# EAGLE design Little Helper Rev 1.9 (EAGLE 7.2.0)
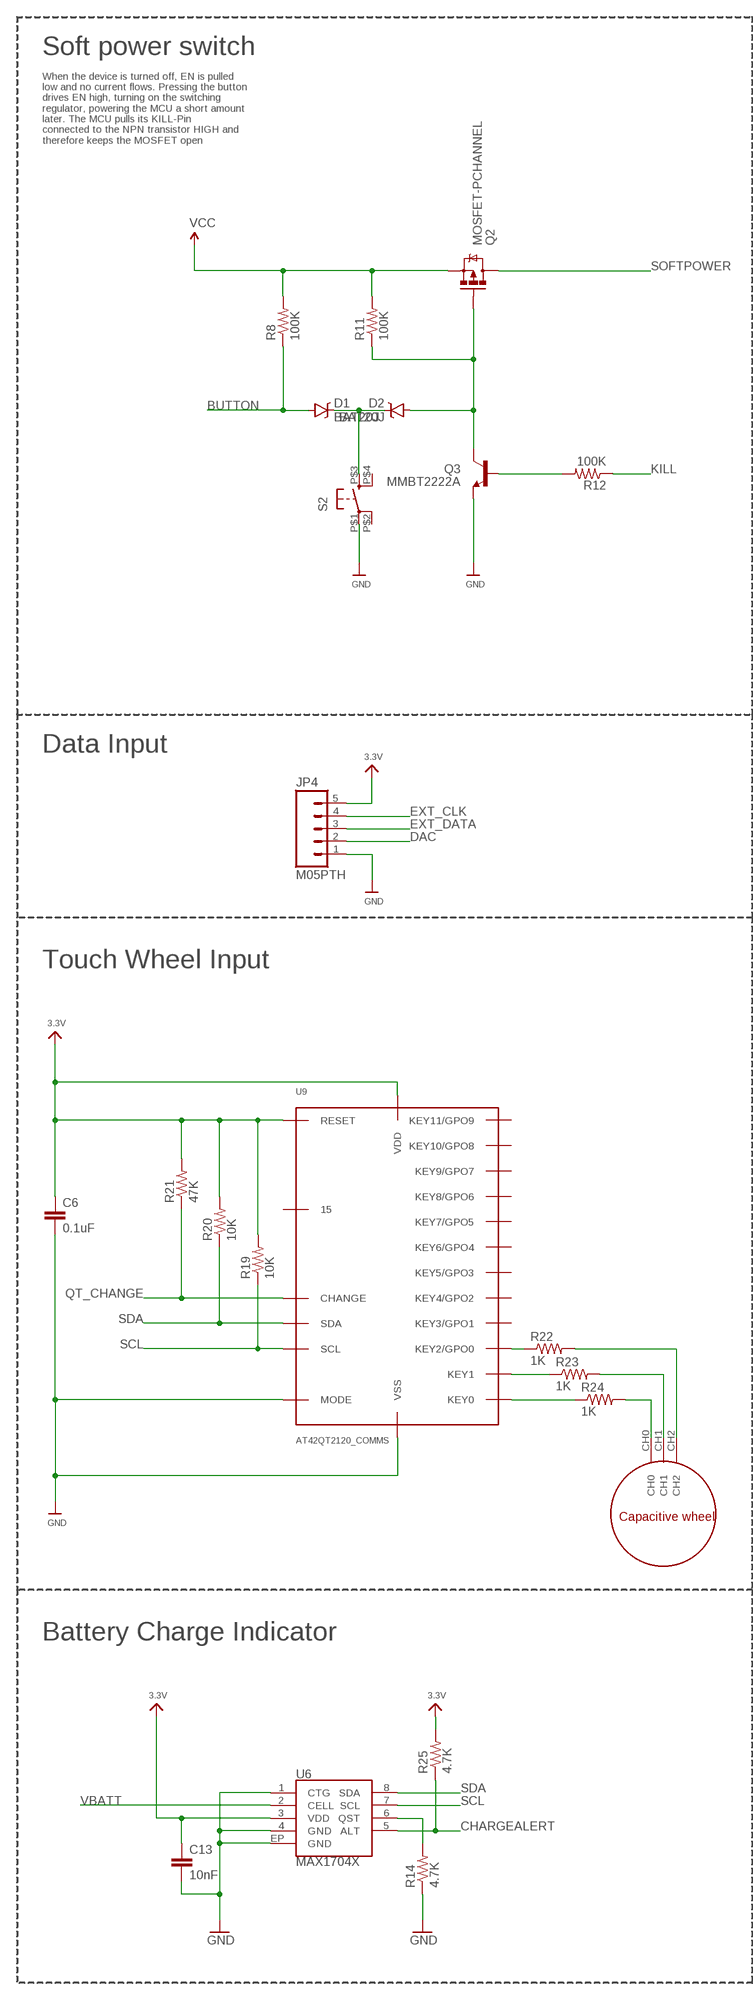
[diagram p0: schematic, sheet 1, part 1 of 2]
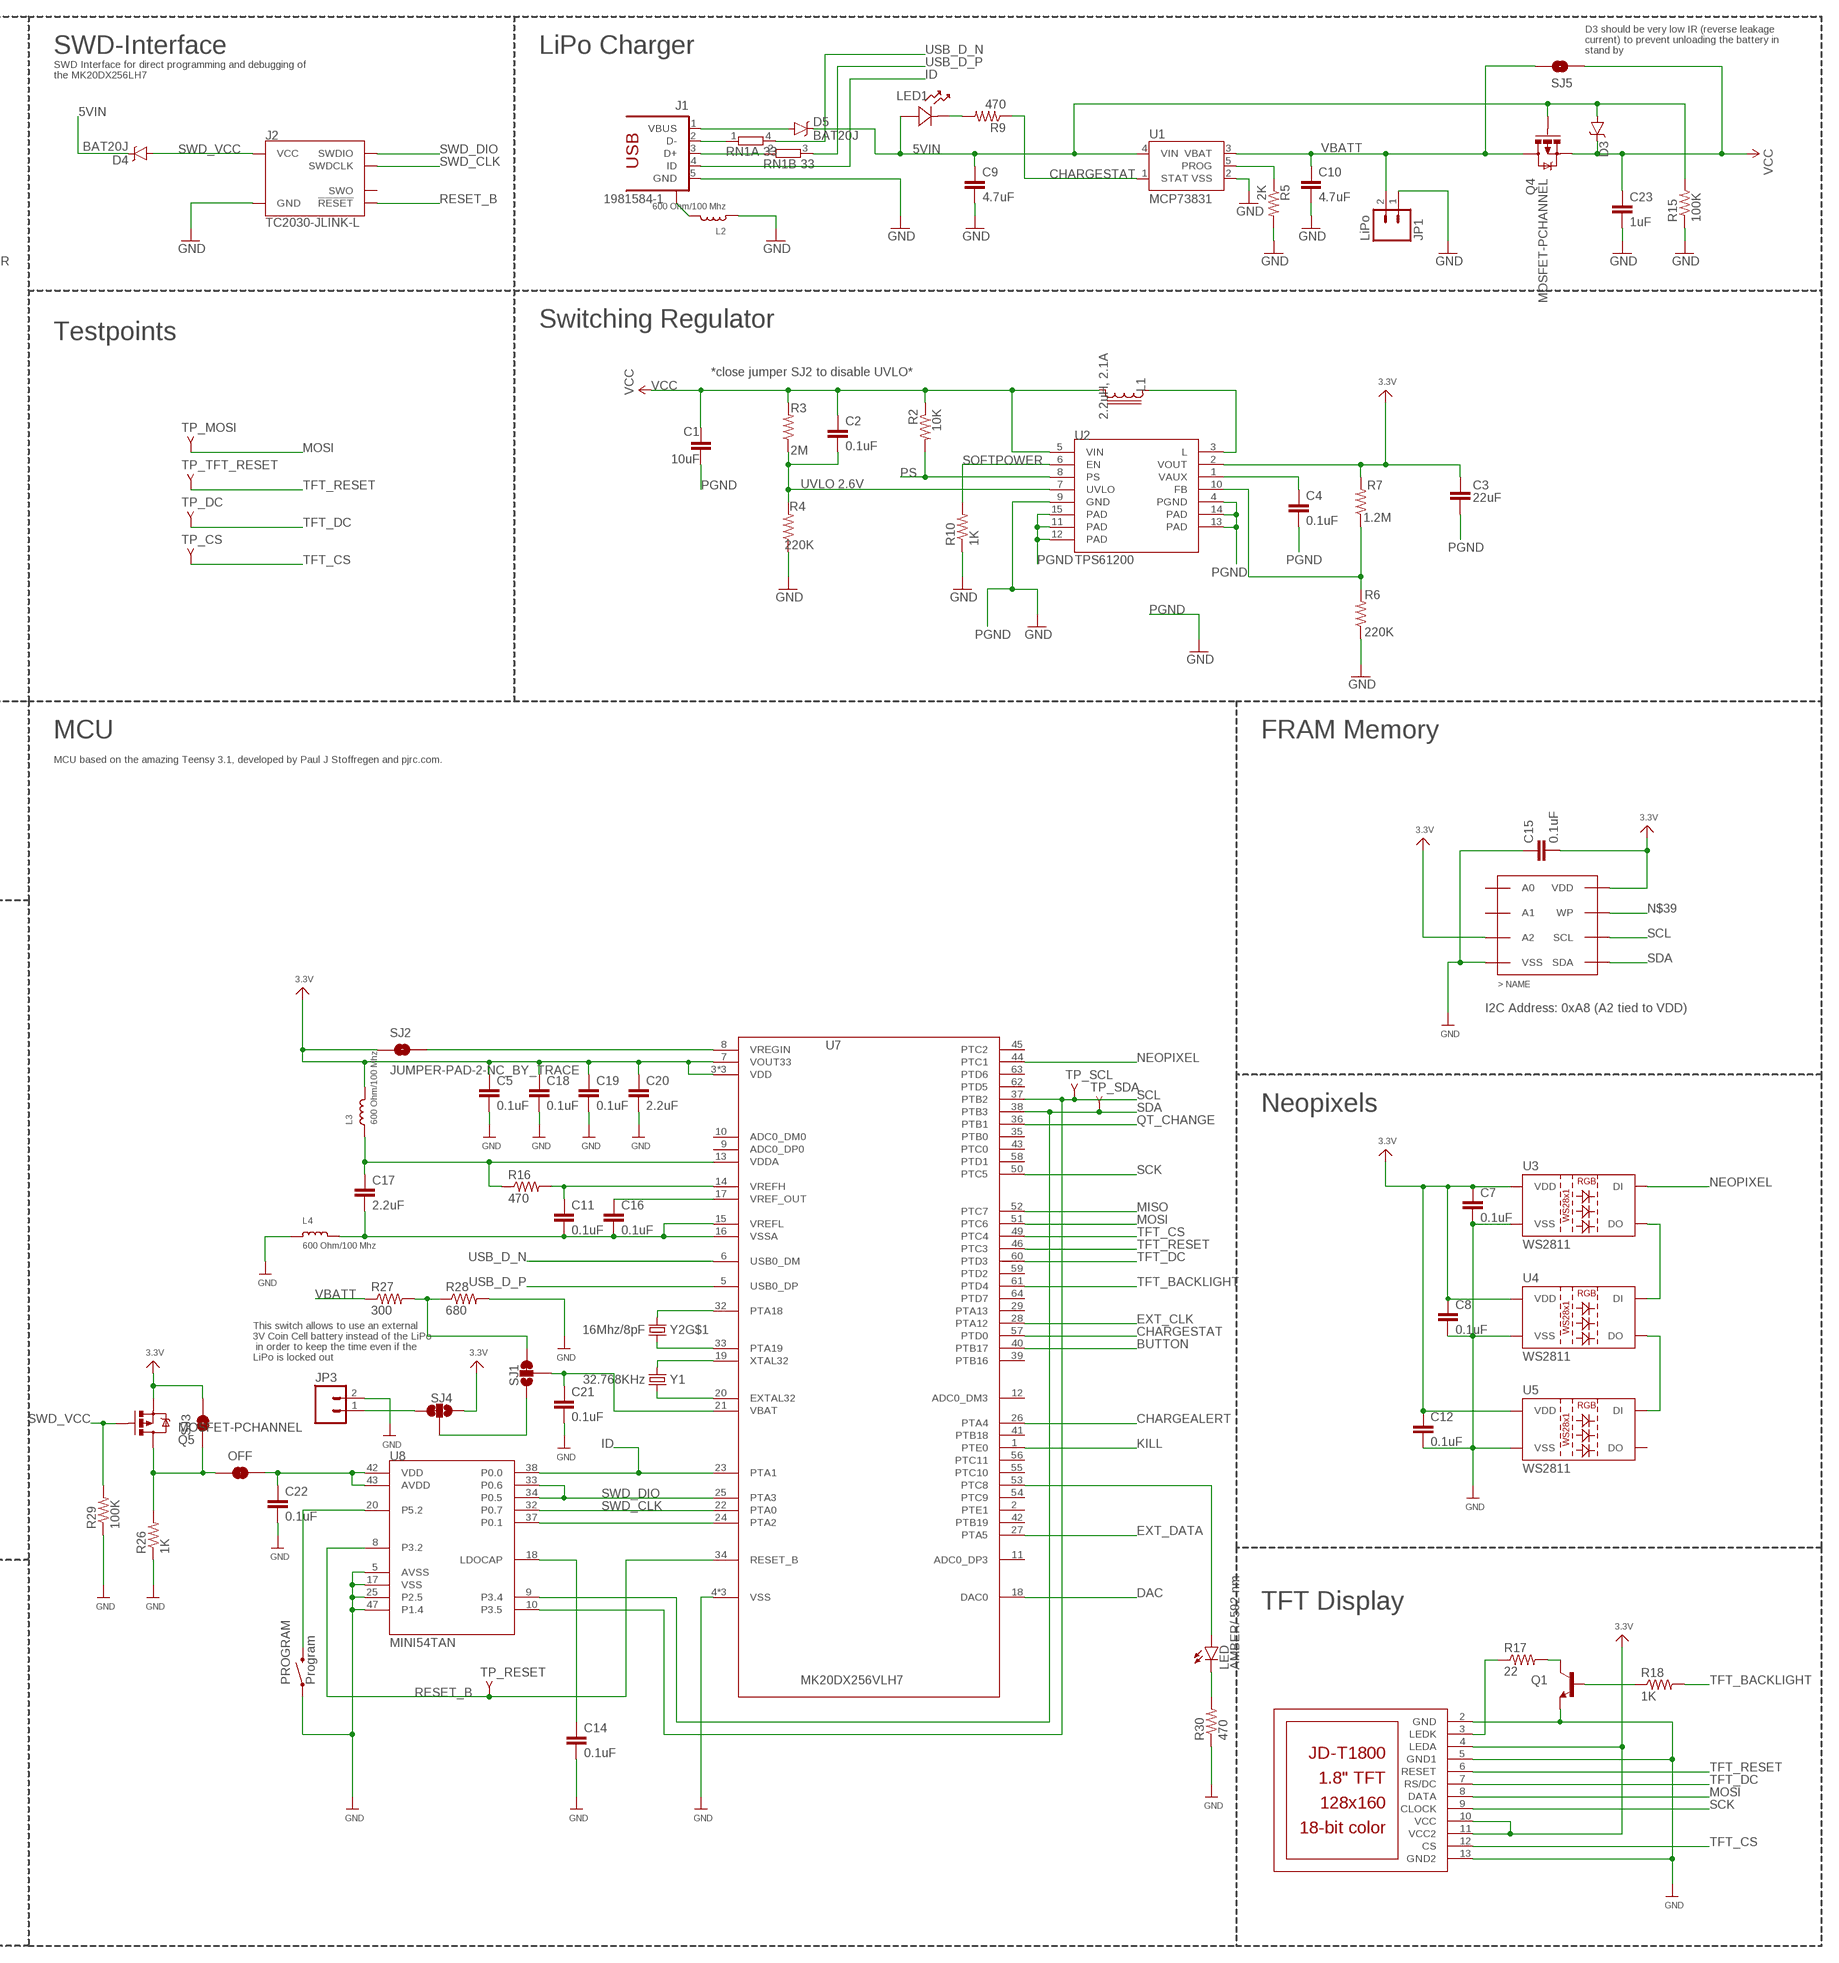
[diagram p1: schematic, sheet 1, part 2 of 2]

## Parts
C1  10uF  CAPACITOR-10UF  [0603-CAP]
C2  0.1uF  CAPACITOR-0.1UF  [0603-CAP]
C3  22uF  CAPACITOR-22UF  [0603-CAP]
C4  0.1uF  CAPACITOR-0.1UF  [0603-CAP]
C5  0.1uF  CAPACITOR-0.1UF  [0603-CAP]
C6  0.1uF  CAPACITOR-0.1UF  [0603-CAP]
C7  0.1uF  CAPACITOR-0.1UF  [0603-CAP]
C8  0.1uF  CAPACITOR-0.1UF  [0603-CAP]
C9  4.7uF  CAPACITOR-4.7UF  [0603-CAP]
C10  4.7uF  CAPACITOR-4.7UF  [0603-CAP]
C11  0.1uF  CAPACITOR-0.1UF  [0603-CAP]
C12  0.1uF  CAPACITOR-0.1UF  [0603-CAP]
C13  10nF  CAPACITOR-10NF  [0603-CAP]
C14  0.1uF  CAPACITOR-0.1UF  [0603-CAP]
C15  0.1uF  CAPACITOR-0.1UF  [0603-CAP]
C16  0.1uF  CAPACITOR-0.1UF  [0603-CAP]
C17  2.2uF  CAPACITOR-2.2UF  [0603-CAP]
C18  0.1uF  CAPACITOR-0.1UF  [0603-CAP]
C19  0.1uF  CAPACITOR-0.1UF  [0603-CAP]
C20  2.2uF  CAPACITOR-2.2UF  [0603-CAP]
C21  0.1uF  CAPACITOR-0.1UF  [0603-CAP]
C22  0.1uF  CAPACITOR-0.1UF  [0603-CAP]
C23  1uF  CAPACITOR-1UF  [0603-CAP]
D1  BAT20J  DIODE-SCHOTTKY-BAT20J  [SOD-323]
D2  BAT20J  DIODE-SCHOTTKY-BAT20J  [SOD-323]
D3  DIODE-SCHOTTKY-LOW_LEAKAGE  [SOD-323]
D4  BAT20J  DIODE-SCHOTTKY-BAT20J  [SOD-323]
D5  BAT20J  DIODE-SCHOTTKY-BAT20J  [SOD-323]
J1  1981584-1  [1981584-1]
J2  TC2030-JLINK-L  [TC2030-IDC]
JP1  LiPo  M02-JST-2MM-SMT  [JST-2-SMD]
JP3  M02PTH  [1X02]
JP4  M05PTH  [1X05]
L1  2.2uH, 2.1A  LPS30152.2UH  [LPS3015]
L2  600 Ohm/100 Mhz  INDUCTOR-BK2125HM601-T  [0805]
L3  600 Ohm/100 Mhz  INDUCTOR-BK2125HM601-T  [0805]
L4  600 Ohm/100 Mhz  INDUCTOR-BK2125HM601-T  [0805]
LCD1  JD-T1800  [JD-T1800]
LED  AMBER/ 592 nm  LED-AMBER  [LED-0603]
LED1  597-2311-407F  [LED_597-2311-407F]
OFF  JUMPER-PAD-2-NC_BY_TRACE  [PAD-JUMPER-2-NC_BY_TRACE_YES_SILK]
PROGRAM  Program  SWITCH-MOMENTARY-2-SMD-1101NE  [TACTILE-SWITCH-1101NE]
Q1  TRANSISTOR_NPNSOT23-3  [SOT23-3]
Q2  MOSFET-PCHANNEL  [SOT23-3]
Q3  MMBT2222A  TRANSISTOR_NPNSOT23-3  [SOT23-3]
Q4  MOSFET-PCHANNEL  [SOT23-3]
Q5  MOSFET-PCHANNEL  [SOT23-3]
R2  10K  RESISTOR-10K  [0603-RES]
R3  2M  RESISTOR-2M  [0603-RES]
R4  220K  RESISTOR-220K  [0603-RES]
R5  2K  RESISTOR-2K  [0603-RES]
R6  220K  RESISTOR-220K  [0603-RES]
R7  1.2M  RESISTOR-1.2M  [0603-RES]
R8  100K  RESISTOR-100K  [0603-RES]
R9  470  RESISTOR-470  [0603-RES]
R10  1K  RESISTOR-1K  [0603-RES]
R11  100K  RESISTOR-100K  [0603-RES]
R12  100K  RESISTOR-100K  [0603-RES]
R14  4.7K  RESISTOR-4.7K  [0603-RES]
R15  100K  RESISTOR-100K  [0603-RES]
R16  470  RESISTOR-470  [0603-RES]
R17  22  RESISTOR-22  [0603-RES]
R18  1K  RESISTOR-1K  [0603-RES]
R19  10K  RESISTOR-10K  [0603-RES]
R20  10K  RESISTOR-10K  [0603-RES]
R21  47K  RESISTOR-47K  [0603-RES]
R22  1K  RESISTOR-1K  [0603-RES]
R23  1K  RESISTOR-1K  [0603-RES]
R24  1K  RESISTOR-1K  [0603-RES]
R25  4.7K  RESISTOR-4.7K  [0603-RES]
R26  1K  RESISTOR-1K  [0603-RES]
R27  300  RESISTOR-300  [0603-RES]
R28  680  RESISTOR-680  [0603-RES]
R29  100K  RESISTOR-100K  [0603-RES]
R30  470  RESISTOR-470  [0603-RES]
RN1  33  2R-NEXB34V  [EXB34V]
S2  TAC_SWITCHPTS645_SERIES  [PTS645_BUTTON_SERIES]
SJ1  JUMPER-PAD-3-2OF3_NC_BY_TRACE  [PAD-JUMPER-3-2OF3_NC_BY_TRACE_YES_SILK_FULL_BOX]
SJ2  JUMPER-PAD-2-NC_BY_TRACE  [PAD-JUMPER-2-NC_BY_TRACE_YES_SILK]
SJ3  JUMPER-PAD-2-NOYES_SILK  [PAD-JUMPER-2-NO_YES_SILK]
SJ4  JUMPER-PAD-3-2OF3_NC_BY_TRACE  [PAD-JUMPER-3-2OF3_NC_BY_TRACE_YES_SILK_FULL_BOX]
SJ5  JUMPER-PAD-2-NOYES_SILK  [PAD-JUMPER-2-NO_YES_SILK]
TP_CS  TPV-PAD-016  [PAD-016]
TP_DC  TPV-PAD-016  [PAD-016]
TP_MOSI  MOSI  TPV-PAD-016  [PAD-016]
TP_RESET  TPV-PAD-016  [PAD-016]
TP_SCL  TPV-PAD-016  [PAD-016]
TP_SDA  TPV-PAD-016  [PAD-016]
TP_TFT_RESET  MOSI  TPV-PAD-016  [PAD-016]
U1  MCP73831  [SOT23-5]
U2  TPS61200  [QFN-10_PAD]
U3  WS2811  LED-TRICOLOR-5050-ICWS2811  [LED-TRICOLOR-5050-IC]
U4  WS2811  LED-TRICOLOR-5050-ICWS2811  [LED-TRICOLOR-5050-IC]
U5  WS2811  LED-TRICOLOR-5050-ICWS2811  [LED-TRICOLOR-5050-IC]
U6  MAX1704X  [TDFN-8]
U7  MK20DX256VLH7  [MK20DX256VLH7]
U8  MINI54TAN  [MINI54TAN]
U9  AT42QT2120_COMMS  [QT2120]
U12  FM24CL64BSOIC8_150MIL  [SO08]
U$1  QTWHEEL_MODULE  [QTWHEELMODULE]
Y1  32.768KHz  CRYSTAL/32.768KHZ/SMD-TXC_7A  [CRYSTAL-TXC-7A]
Y2  16Mhz/8pF  CRYSTAL/SMD-5X3-GND16MHZ/8PF  [CRYSTAL-SMD-5X3]

## Nets
3.3V: C3.1 C5.1 C6.1 C7.1 C8.1 C12.1 C13.1 C15.2 C18.1 C19.1 C20.1 JP4.5 L3.2 LCD1.4(LEDA) LCD1.10(VCC) LCD1.11(VCC2) Q5.2(S) R7.2 R19.2 R20.2 R21.2 R25.2 SJ2.1 SJ3.2 SJ4.1 U2.2(VOUT) U3.3(VDD) U3.5(VDD) U4.3(VDD) U4.5(VDD) U5.3(VDD) U5.5(VDD) U6.3(VDD) U7.3(VDD) U7.7(VOUT33) U7.30(VDD) U7.48(VDD) U9.11(VDD) U9.14(RESET) U12.3(A2) U12.8(VDD)
5VIN: C9.1 D3.A D4.C D5.C LED1.2 Q4.1(G) R15.2 U1.4(VIN)
BUTTON: D1.A R8.1 U7.40(PTB17)
CHARGEALERT: R25.1 U6.5(ALT) U7.26(PTA4)
CHARGESTAT: R9.1 U1.1(STAT) U7.57(PTD0)
DAC: JP4.2 U7.18(DAC0)
EXT_CLK: JP4.4 U7.28(PTA12)
EXT_DATA: JP4.3 U7.27(PTA5)
FB: R6.2 R7.1 U2.10(FB)
GND [Top GND Pour]: C5.2 C6.2 C7.2 C8.2 C9.2 C10.2 C12.2 C13.2 C14.2 C15.1 C18.2 C19.2 C20.2 C21.2 C22.2 C23.2 J1.5(GND) J2.5(GND) JP1.1 JP3.2 JP4.1 L2.1 L4.1 LCD1.2(GND) LCD1.5(GND1) LCD1.13(GND2) PROGRAM.P$1 Q1.2(E) Q3.2(E) R4.1 R5.2 R6.1 R10.1 R14.1 R15.1 R26.1 R28.2 R29.1 R30.1 S2.P$1 U1.2(VSS) U3.6(VSS) U4.6(VSS) U5.6(VSS) U6.1(CTG) U6.4(GND) U6.EP(GND) U7.4(VSS) U7.31(VSS) U7.47(VSS) U8.5(AVSS) U8.17(VSS) U8.25(P2.5) U8.47(P1.4) U9.10(VSS) U9.12(MODE) U12.4(VSS)
ID: J1.4(ID) U7.23(PTA1) U8.38(P0.0)
KILL: R12.1 U7.1(PTE0)
MISO: U7.52(PTC7)
MOSI: LCD1.8(DATA) TP_MOSI.1(TP) U7.51(PTC6)
N$1: OFF.1 Q5.3(D) R26.2 SJ3.1
N$2: L1.1 U2.3(L)
N$3: D2.A Q2.1(G) Q3.3(C) R11.1
N$4: Q3.1(B) R12.2
N$6: D1.C D2.C S2.P$3
N$8: LED1.1 R9.2
N$9: C21.1 SJ1.2 U7.21(VBAT)
N$10: C22.1 OFF.2 U8.42(VDD) U8.43(AVDD)
N$11: R5.1 U1.5(PROG)
N$12: LED.A U7.53(PTC8)
N$13: D5.A J1.1(VBUS)
N$14: JP3.1 SJ4.3
N$15: U7.24(PTA2) U8.37(P0.1)
N$16: R22.1 U9.7(KEY2/GPO0)
N$17: R23.1 U9.8(KEY1)
N$18: LED.C R30.2
N$19: PROGRAM.P$2 U8.20(P5.2)
N$20: SJ1.1 SJ4.2
N$22: C14.1 U8.18(LDOCAP)
N$27: U7.32(PTA18) Y2.3
N$28: U7.33(PTA19) Y2.1
N$29: U7.19(XTAL32) Y1.P$2
N$30: U7.20(EXTAL32) Y1.P$1
N$31: R27.2 R28.1 SJ1.3
N$33: LCD1.3(LEDK) R17.1
N$34: R24.1 U9.9(KEY0)
N$37: U3.1(DO) U4.2(DI)
N$39: U12.7(WP)
N$42: Q1.3(C) R17.2
N$43: Q1.1(B) R18.1
N$44: R22.2 U$1.CH2
N$45: R23.2 U$1.CH1
N$46: R24.2 U$1.CH0
N$47: U4.1(DO) U5.2(DI)
N$48: R14.2 U6.6(QST)
NEOPIXEL: U3.2(DI) U7.44(PTC1)
PGND: C1.2 C3.2 C4.2 U2.4(PGND) U2.9(GND) U2.11(PAD) U2.12(PAD) U2.13(PAD) U2.14(PAD) U2.15(PAD) ; supply symbol labelled GND
PS: R2.2 U2.8(PS)
QT_CHANGE: R21.1 U7.36(PTB1) U9.17(CHANGE)
RESET_B: J2.3(!RESET) TP_RESET.1(TP) U7.34(RESET_B) U8.8(P3.2)
SCK: LCD1.9(CLOCK) U7.50(PTC5)
SCL: R19.1 TP_SCL.1(TP) U6.7(SCL) U7.37(PTB2) U8.10(P3.5) U9.16(SCL) U12.6(SCL)
SDA: R20.1 TP_SDA.1(TP) U6.8(SDA) U7.38(PTB3) U8.9(P3.4) U9.13(SDA) U12.5(SDA)
SOFTPOWER: Q2.3(D) R10.2 U2.6(EN)
SWD_CLK: J2.4(SWDCLK) U7.22(PTA0) U8.32(P0.7)
SWD_DIO: J2.2(SWDIO) U7.25(PTA3) U8.33(P0.6) U8.34(P0.5)
SWD_VCC: D4.A J2.1(VCC) Q5.1(G) R29.2
TFT_BACKLIGHT: R18.2 U7.61(PTD4)
TFT_CS: LCD1.12(CS) TP_CS.1(TP) U7.49(PTC4)
TFT_DC: LCD1.7(RS/DC) TP_DC.1(TP) U7.60(PTD3)
TFT_RESET: LCD1.6(RESET) TP_TFT_RESET.1(TP) U7.46(PTC3)
USB_CON_N [USB]: J1.2(D-) RN1.1
USB_CON_P [USB]: J1.3(D+) RN1.2
USB_D_N [USB]: RN1.4 U7.6(USB0_DM)
USB_D_P [USB]: RN1.3 U7.5(USB0_DP)
USB_SHIELD: J1.S1 L2.2
UVLO: C2.2 R3.1 R4.2 U2.7(UVLO)
VAUX: C4.1 U2.1(VAUX)
VBATT: C10.1 JP1.2 Q4.3(D) R27.1 SJ5.2 U1.3(VBAT) U6.2(CELL)
VCC: C1.1 C2.1 C23.1 D3.C L1.2 Q2.2(S) Q4.2(S) R2.1 R3.2 R8.2 R11.2 SJ5.1 U2.5(VIN)
VDDA: C17.1 L3.1 R16.1 U7.13(VDDA)
VREF_OUT: C16.1 U7.17(VREF_OUT)
VREFH: C11.1 R16.2 U7.14(VREFH)
VREFL: C11.2 C16.2 C17.2 L4.2 U7.15(VREFL) U7.16(VSSA)
VREGIN: SJ2.2 U7.8(VREGIN)
Unconnected: J1.S2 J1.S3 J1.S4 J2.6(SWO) S2.P$2 S2.P$4 U5.1(DO) U7.2(PTE1) U7.9(ADC0_DP0) U7.10(ADC0_DM0) U7.11(ADC0_DP3) U7.12(ADC0_DM3) U7.29(PTA13) U7.35(PTB0) U7.39(PTB16) U7.41(PTB18) U7.42(PTB19) U7.43(PTC0) U7.45(PTC2) U7.54(PTC9) U7.55(PTC10) U7.56(PTC11) U7.58(PTD1) U7.59(PTD2) U7.62(PTD5) U7.63(PTD6) U7.64(PTD7) U9.1(KEY8/GPO6) U9.2(KEY7/GPO5) U9.3(KEY6/GPO4) U9.4(KEY5/GPO3) U9.5(KEY4/GPO2) U9.6(KEY3/GPO1) U9.15 U9.18(KEY11/GPO9) U9.19(KEY10/GPO8) U9.20(KEY9/GPO7) U12.1(A0) U12.2(A1) Y2.2(GND:GND) Y2.4(GND:GND)

## Notes on the sheet
- Soft power switch | SWD-Interface | LiPo Charger
- D3 should be very low IR (reverse leakage
  current) to prevent unloading the battery in
  stand by
- SWD Interface for direct programming and debugging of
  the MK20DX256LH7
- When the device is turned off, EN is pulled
  low and no current flows. Pressing the button
  drives EN high, turning on the switching
  regulator, powering the MCU a short amount
  later. The MCU pulls its KILL-Pin
  connected to the NPN transistor HIGH and
  therefore keeps the MOSFET open
- Switching Regulator
- Testpoints
- *close jumper SJ2 to disable UVLO*
- UVLO 2.6V
- Data Input | MCU | FRAM Memory
- MCU based on the amazing Teensy 3.1, developed by Paul J Stoffregen and pjrc.com.
- Touch Wheel Input
- I2C Address: 0xA8 (A2 tied to VDD)
- Neopixels
- This switch allows to use an external 
  3V Coin Cell battery instead of the LiPo
   in order to keep the time even if the 
  LiPo is locked out
- Battery Charge Indicator | TFT Display

## Library data of the parts
C1 = appfruits:CAPACITOR; MF: Murata; MPN: GRM188R60J106ME47D
C2 C4-C8 C11 C12 C14-C16 C18 C19 C21 C22 = appfruits:CAPACITOR; MF: Kemet; MPN: C0603C104J3RACTU
C3 = appfruits:CAPACITOR; MF: Murata; MPN: GRM188R60J226MEA0D
C9 C10 = appfruits:CAPACITOR; MF: Murata; MPN: GRM188R60J475KE19D
C13 = appfruits:CAPACITOR; MF: Kemet; MPN: C0603C103K5RACTU
C17 C20 = appfruits:CAPACITOR; MF: Kemet; MPN: C0603C225K4PACTU
C23 = appfruits:CAPACITOR; MF: Murata; MPN: GRM188R61E105KA12D
D1 D2 D4 D5 = appfruits:DIODE-SCHOTTKY: Schottky diodes in SFE's production catalog BAT20J 1A 23V 0.62Vf RB751 120mA 40V 0.37Vf PMEG4005EJ 0.5A 40V 0.42Vf MBRA140 1A 40V 0.5Vf B340A 3A 40V SMA LOW_LEAKAGE 0.57 A 10V 2.5uA IR; MF: STMicroelectronics; MPN: BAT20JFILM; PROD_ID: DIO-11623
D3 = appfruits:DIODE-SCHOTTKY: Schottky diodes in SFE's production catalog BAT20J 1A 23V 0.62Vf RB751 120mA 40V 0.37Vf PMEG4005EJ 0.5A 40V 0.42Vf MBRA140 1A 40V 0.5Vf B340A 3A 40V SMA LOW_LEAKAGE 0.57 A 10V 2.5uA IR; MF: Diodes Incorporated; MPN: ZLLS410TA
J1 = con-usb:1981584-1: Receptacle, micro-USB, type A/B Tyco Electronics; MF: Hirose; MPN: ZX62-AB-5PA(11)
J2 = connector:TC2030-JLINK
JP1 = appfruits:M02: Standard 2-pin 0.1" header. Use with - straight break away headers ( PRT-00116) - right angle break away headers (PRT-00553) - swiss pins (PRT-00743) - machine pins (PRT-00117) - female headers (PRT-00115) Molex polarized connector foot print use with: PRT-08233 with associated crimp pins and housings. 2.54_SCREWTERM for use with PRT-10571. 3.5mm Screw Terminal footprints for PRT-08084 5mm Screw Terminal footprints for use with PRT-08432; PROD_ID: CONN-08352
JP3 = SparkFun-Connectors:M02: Standard 2-pin 0.1" header. Use with - straight break away headers ( PRT-00116) - right angle break away headers (PRT-00553) - swiss pins (PRT-00743) - machine pins (PRT-00117) - female headers (PRT-00115) Molex polarized connector foot print use with: PRT-08233 with associated crimp pins and housings. 2.54_SCREWTERM for use with PRT-10571. 3.5mm Screw Terminal footprints for PRT-08084 5mm Screw Terminal footprints for use with PRT-08432
JP4 = appfruits:M05: Header 5 Standard 5-pin 0.1" header. Use with straight break away headers (SKU : PRT-00116), right angle break away headers (PRT-00553), swiss pins (PRT-00743), machine pins (PRT-00117), and female headers (PRT-00115). Molex polarized connector foot print use with SKU : PRT-08230 with associated crimp pins and housings.
L1 = appfruits:LPS3015: Shielded Power Inductor; MF: Coilcraft; MPN: LPS3015-222MRB
L2-L4 = appfruits:INDUCTOR: Inductors 0603: 10nH Ceramic Inductor - microwire antenna/RF (Digikey: 712-1434-2-ND) 0805: 560nH Ceramic Inductor - RF (Digikey: 553-1047-1-ND) 270nH Ceramic Inductor - Q = 40@250MHz, +-5%, 1 Ohm DC Resistance (Digikey: 535-10506-2-ND) 1007 (2518 Metric) SMT: 10µH 10% 250mOhm 820mA 1007 Inductor (Digikey: 587-2189-1-ND) 22µH 10% 500mOhm 580mA 1007 Inductor (Digikey: 587-2190-1-ND) 47µH 10% 950mOhm 420mA 1007 Inductor (Digikey: 587-2191-1-ND) 47µH 5% 100mOhm 1A 1008 Inductor (Digikey: 732-1816-1-ND) 5.0x5.0mm (Taiyo Yuden NR5040 Series) 6.8µH 20% 2.3A 64mOhm Inductor (Digikey: 587-2374-2-ND) 5.0x5.0mm (TDK VLC5045 Series) 4.7µH 20% 3.3A 34mOhm Inductor (Digikey: 445-6526-1-ND) 6.8µH 20% 2.7A 46mOhm Inductor (Digikey: 445-6527-1-ND) 6.0x6.0mm (TDK VLC6045 Series) 4.7µH 20% 3.8A 27mOhm Inductor (Digikey: 445-6538-2-ND) 6.8µH 20% 3A 41mOhm Inductor (Digikey: 445-6540-1-ND) 6.2µH 30% 2.2A 45mOhm Inductor (Digikey: SRR5028-6R2YCT-ND) - Not TDK VLC6045 but footprint should match 6.0x6.0mm (TDK SLF6045 Series) 6.8uH 30% 2A 33mOhm Inductor (Digikey: 445-4572-1-ND, Mouser: 810-SLF645T6R8N2R0PF) 6.0x6.0mm (Sumida CDRH5D28 Series) 6.2uH 30% 1.8A 45mOhm Inductor (Digikey: 308-1542-1-ND) Taiyo Yuden NR3015T2R2M - 2.2uH 20% 1.5A (Digikey: 587-1648-2-ND, Mouser: 963-NR3015T2R2M) - Used with TI TPS62172 CoilCraft RFID Transponder Coil - MA5532-AE (For use with AS3935 Lightning Sensor); MF: Taiyo Yuden; MPN: BK2125HM601-T
LCD1 = adafruit:JD-T1800
LED = appfruits:LED: LEDs Standard schematic elements and footprints for 5mm, 3mm, 1206, and 0603 sized LEDs. 5mm - Spark Fun Electronics SKU : COM-00529 (and others); MF: Avago Technologies; MPN: HSMA-C190
LED1 = Dialight_By_element14_Batch_1:597-2311-407F: LED RIGHT ANGLE GREEN SMD 1208; COLOR: GREEN; MPN: 597-2311-407F; OC_FARNELL: 1470685; OC_NEWARK: 30K4865; PACKAGE: LED SMD R/A; SUPPLIER: Dialight
OFF SJ2 = SparkFun-Passives:JUMPER-PAD-2-NC_BY_TRACE
PROGRAM = SparkFun-Electromechanical:SWITCH-MOMENTARY-2: Various NO switches- pushbuttons, reed, etc; MF: C&K Components; MPN: RS-282G05A3-SM RT
Q1 Q3 = appfruits:TRANSISTOR_NPN: Generic NPN BJT MMBT2222A - TRANS-08049 (SOT-23, 1A 40V) MPSA42 - TRANS-09116 (SOT-23, 500mA 300V) MMBT5088LT1G - TRANS-11160 (SOT-23, 50 mA 30V) BC547 - COM-08928 <http://www.sparkfun.com/products/8928> (TO-92 45V 100mA) (1.Collector 2.Base 3.Emitter) 2N3904 - COM-00521 <http://www.sparkfun.com/products/521> (TO-92 40V 200mA) (1.Emitter 2.Base 3.Collector) P2N2222A - COM-12852 <http://www.sparkfun.com/products/12852> (TO-92 40V 600mA) (1.Collector 2.Base 3.Emitter); MF: ON Semiconductor; MPN: MMBT2222ALT1G
Q2 Q4 Q5 = SparkFun-DiscreteSemi:MOSFET-PCHANNEL: Generic PMOSFET IRLML2244 - TRANS-11153 (SOT-23 -20V -4.3A) (1.Gate 2.Source 3.Drain) FQP27P06 - COM-10349 <http://www.sparkfun.com/products/10349> (TO-220 -60V -27A) (1.Gate 2.Source 3.Drain); MF: ON Semiconductor; MPN: BSS84LT1G; PROD_ID: TRANS-08285
R2 R19 R20 = appfruits:RESISTOR: Resistor Basic schematic elements and footprints for 0603, 1206, and PTH resistors.; MF: Panasonic; MPN: ERJ-3GEYJ103V
R3 = appfruits:RESISTOR: Resistor Basic schematic elements and footprints for 0603, 1206, and PTH resistors.; MF: Panasonic; MPN: ERJ-3GEYJ205V
R4 R6 = appfruits:RESISTOR: Resistor Basic schematic elements and footprints for 0603, 1206, and PTH resistors.; MF: Panasonic; MPN: ERJ-3GEYJ224V
R5 = appfruits:RESISTOR: Resistor Basic schematic elements and footprints for 0603, 1206, and PTH resistors.; MF: Panasonic; MPN: ERJ-3GEYJ202V
R7 = appfruits:RESISTOR: Resistor Basic schematic elements and footprints for 0603, 1206, and PTH resistors.; MF: Panasonic; MPN: ERJ-3GEYJ125V
R8 R11 R12 R15 R29 = appfruits:RESISTOR: Resistor Basic schematic elements and footprints for 0603, 1206, and PTH resistors.; MF: Panasonic; MPN: ERJ-3EKF1003V
R9 R16 R30 = appfruits:RESISTOR: Resistor Basic schematic elements and footprints for 0603, 1206, and PTH resistors.; MF: Panasonic; MPN: ERJ-3GEYJ471V
R10 R18 R22-R24 R26 = appfruits:RESISTOR: Resistor Basic schematic elements and footprints for 0603, 1206, and PTH resistors.; MF: Panasonic; MPN: ERJ-3GEYJ102V
R14 R25 = appfruits:RESISTOR: Resistor Basic schematic elements and footprints for 0603, 1206, and PTH resistors.; MF: Panasonic; MPN: ERJ-3EKF4701V
R17 = appfruits:RESISTOR: Resistor Basic schematic elements and footprints for 0603, 1206, and PTH resistors.; MF: Panasonic; MPN: ERJ-3GEYJ220V
R21 = appfruits:RESISTOR: Resistor Basic schematic elements and footprints for 0603, 1206, and PTH resistors.; MF: Panasonic; MPN: ERJ-3EKF4702V
R27 = appfruits:RESISTOR: Resistor Basic schematic elements and footprints for 0603, 1206, and PTH resistors.; MF: Panasonic; MPN: ERJ-3EKF3000V
R28 = appfruits:RESISTOR: Resistor Basic schematic elements and footprints for 0603, 1206, and PTH resistors.; MF: Panasonic; MPN: ERJ-3EKF6800V
RN1 = resistor-dil:2R-N: Array Chip Resistor Source: Panasonic; MF: Panasonic; MPN: EXB-34V330JV; OC_FARNELL: unknown; OC_NEWARK: unknown
S2 = appfruits:TAC_SWITCH: Momentary Switch Button commonly used for reset or general input. Spark Fun Electronics SKU : COM-00097 SMT- SWCH-08247; MF: C&K Components; MPN: PTS645SH50SMTR 92 LFS
SJ1 SJ4 = appfruits:JUMPER-PAD-3-2OF3_NC_BY_TRACE
SJ3 SJ5 = SparkFun-Passives:JUMPER-PAD-2-NO
TP_CS = appfruits:TPV: TEST POINT PAD; LABEL: CS
TP_DC = appfruits:TPV: TEST POINT PAD; LABEL: DC
TP_MOSI = appfruits:TPV: TEST POINT PAD; LABEL: MOSI
TP_RESET = appfruits:TPV: TEST POINT PAD; LABEL: RESET
TP_SCL = appfruits:TPV: TEST POINT PAD; LABEL: SCL
TP_SDA = appfruits:TPV: TEST POINT PAD; LABEL: SDA
TP_TFT_RESET = appfruits:TPV: TEST POINT PAD; LABEL: RES
U1 = SparkFun:MCP73831: Microchip's MCP73831 Miniature single cell, fully integrated Li-Ion, Li-polymer charge management controller http://ww1.microchip.com/downloads/en/DeviceDoc/21984a.pdf; MF: Microchip; MPN: MCP73831T-2ACI/OT
U2 = appfruits:TPS61200: DC to DC Booster IC-10035; MF: Texas Instruments; MPN: TPS61200DRCR; PROD_ID: IC-10035
U3-U5 = SparkFun-LED:LED-TRICOLOR-5050-IC: WS2812 RGB LED w/ WS2811 driver 5x5mm SMD LED with built-in controller IC. DIO-11598; PROD_ID: DIO-11598
U6 = appfruits:MAX1704X: MAX17043/MAX17044: Battery Fuel Guage (43 is 1cell, 44 is 2cell); MF: Maxim Integrated; MPN: 700-MAX17043G+U
U7 = appfruits:MK20DX256VLH7; MF: Freescale; MPN: MK20DX256VLH7
U8 = TeensyCustom:MINI54TAN: MINI54TAN Bootloader from PJRC.com, preprogrammed with Teensy 3.0 bootloader. https://www.pjrc.com/store/ic_mini54_tqfp.html
U9 = appfruits:AT42QT2120_COMMS: AT42QT2120 in Comms Mode in SSOP20 Package; MF: Atmel; MPN: AT42QT2120-MMH
U12 = appfruits:FM24CL64B: 64 KB I2C FRAM Memory IC with very fast read and write cycles. Two-Wire Model.; MF: Cypress Semiconductor; MPN: FM24CL64B-GTR
U$1 = appfruits:QTWHEEL_MODULE
Y1 = appfruits:CRYSTAL/32.768KHZ/SMD-TXC_7A; MF: Epson Timing; MPN: FC-255 32.7680K-A3
Y2 = appfruits:CRYSTAL/SMD-5X3-GND; MF: ECS; MPN: ECS-160-8-30B-CKM

## Net classes
1 USB: width 0.254 mm, drill 0.33 mm, clearance 0.159 mm
2 Top GND Pour: clearance 0.762 mm to class 1

## Board
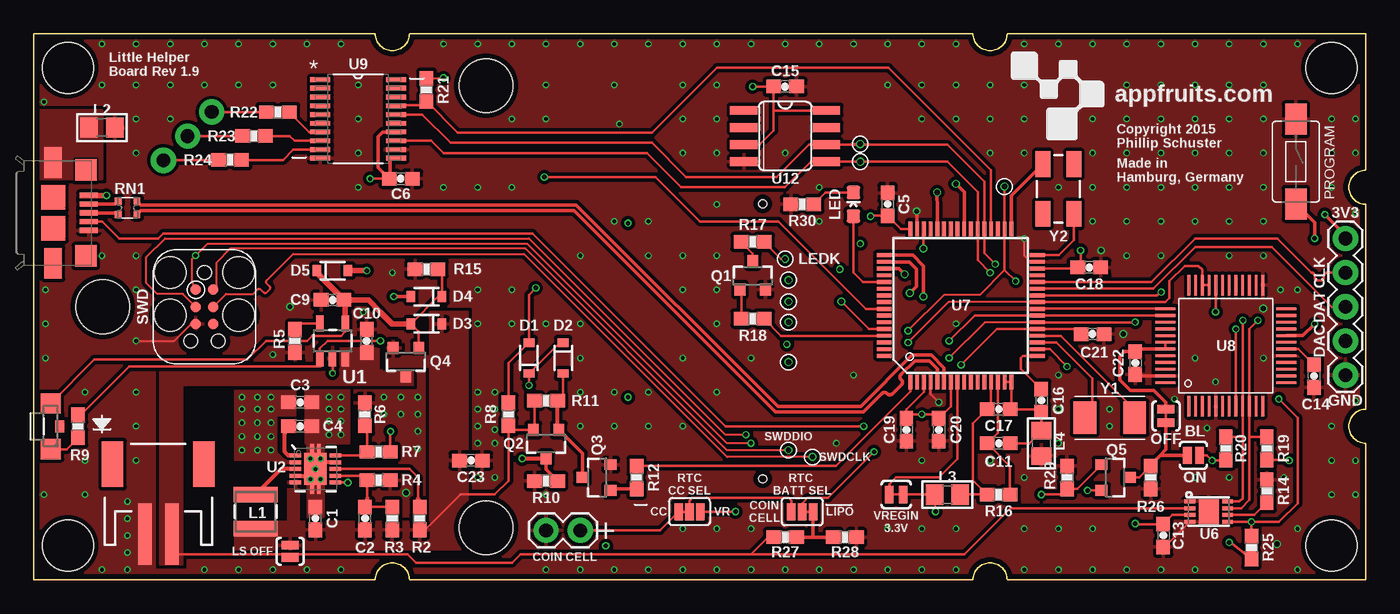
[diagram p2: board, top side]
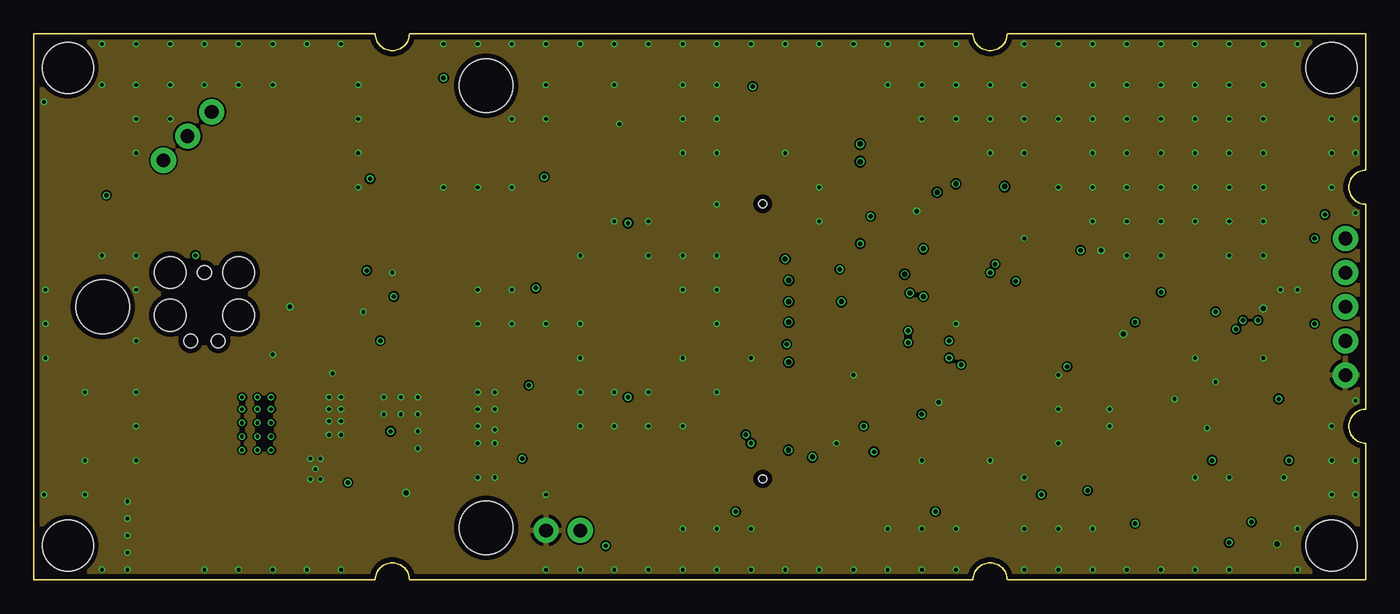
[diagram p3: board, inner layer GND]
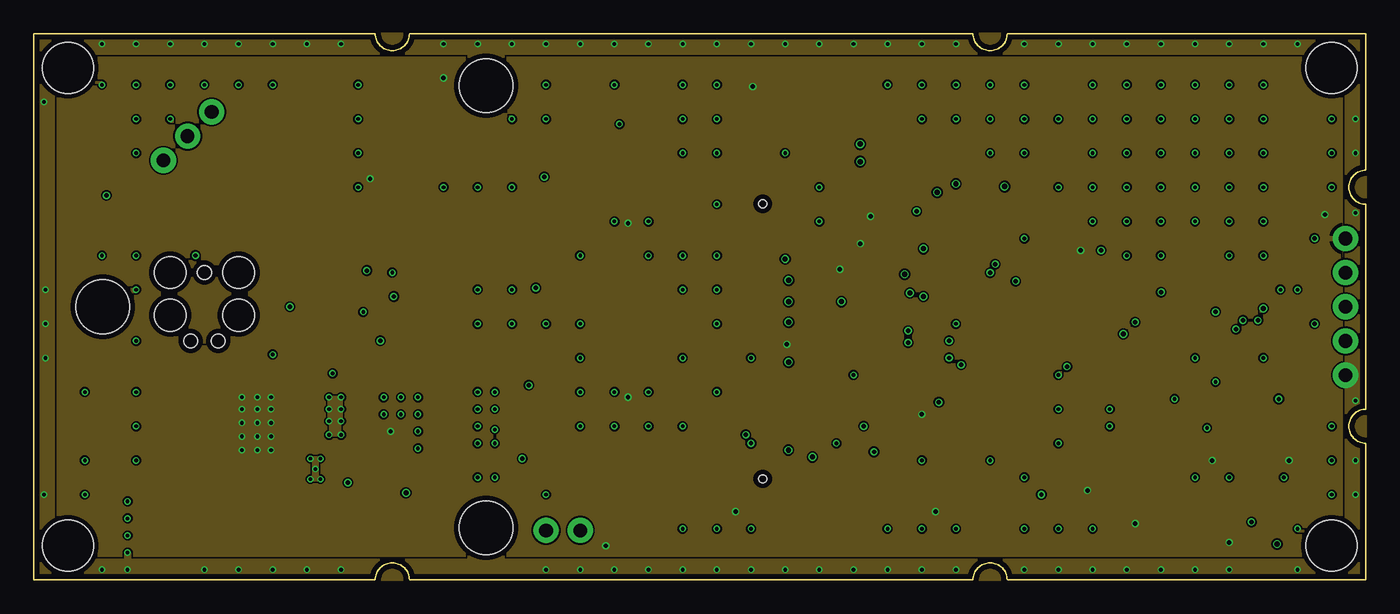
[diagram p4: board, inner layer 3V3]
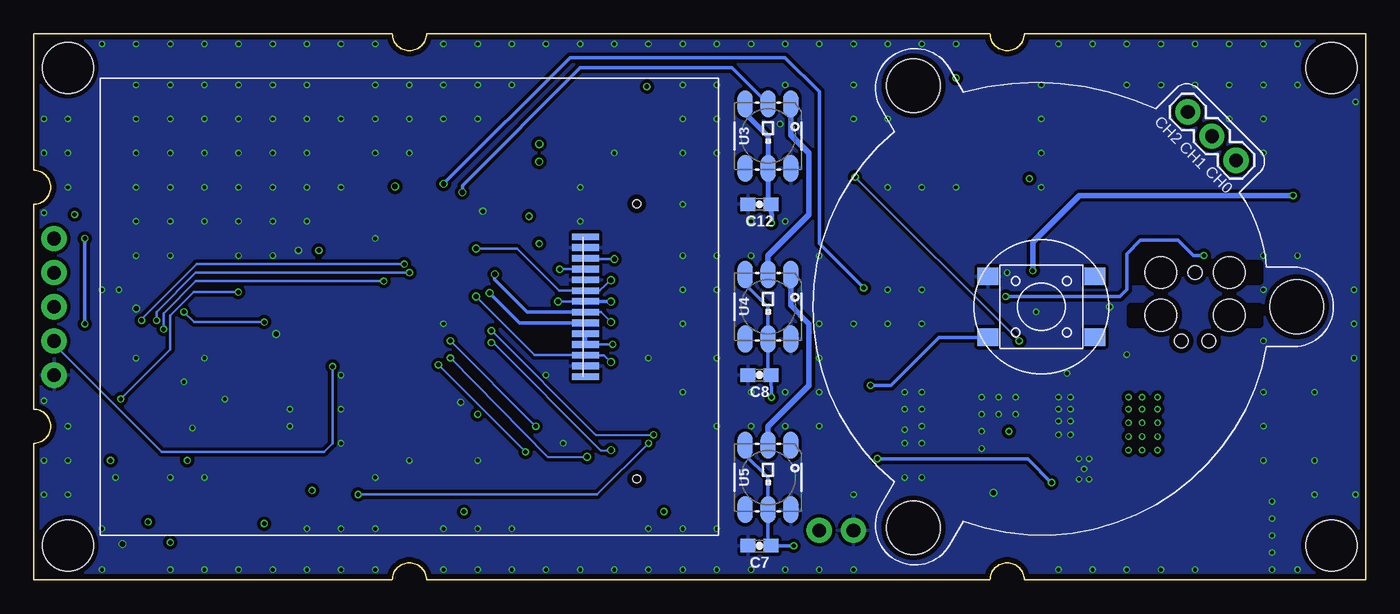
[diagram p5: board, bottom side, seen from below]

Size 99.06 x 40.64 mm. Coordinates in mm from the lower left corner, seen from the top.
Outline: 0,0 25.4,0 arc-180 27.94,0 69.85,0 arc-180 72.39,0 99.06,0 99.06,10.16 arc-180 99.06,12.7 99.06,27.94 arc-180 99.06,30.48 99.06,40.64 72.39,40.64 arc-180 69.85,40.64 27.94,40.64 arc-180 25.4,40.64 0,40.64 0,0
Copper layers (1*2*15*16): Top 0.035559375mm / dielectric 0.17018125mm / GND 0.01778125mm / dielectric 47mil / 3V3 0.01778125mm / dielectric 0.17018125mm / Bottom 0.035559375mm
Design rules "OSHPark-4layer *": minimum track width 5mil, minimum drill 10mil, track to track 5mil, track to pad 5mil, pad to pad 5mil, via to via 5mil, smd to smd 5mil, copper to edge 15mil, drill to drill 6mil, minimum pad ring 4mil, minimum via ring 4mil, stop-mask expansion 4mil, vias tented up to drill 12mil, thermal gap 10mil
Holes 3.8 mm at 2.54,38.1 2.54,2.54 96.52,38.1 96.52,2.54

### Footprints (pad centres in the part's own frame; a part is rotated, then mirrored left to right if it is on the bottom)
0603-CAP = smd 1.1 x 1: 1 -0.85,0; 2 0.85,0
SOD-323 = smd 0.63 x 0.83: A 1.15,0; C -1.15,0
1981584-1 = smd 0.4 x 1.35: 1 -1.3,4.1; 2 -0.65,4.1; 3 0,4.1; 4 0.65,4.1; 5 1.3,4.1 | smd 1.8 x 1.8: M1 -1.15,1.45; M2 1.15,1.45 | smd 2.3 x 1.3: S1 -3.75,1.45; S2 3.75,1.45 | smd 1.6 x 1.6: S3 -3.2,3.885; S4 3.2,3.885
TC2030-IDC = smd 0.787 x 0.787: 1 -1.27,-0.635; 2 -1.27,0.635; 3 0,-0.635; 4 0,0.635; 5 1.27,-0.635; 6 1.27,0.635 | hole 2.375: -2.54,2.54; 0.635,2.54; 0.635,-2.54; -2.54,-2.54 | hole 1.016: -2.54,0; 2.54,1.016; 2.54,-1.016
JST-2-SMD = smd 1 x 4.6: 1 -1,-3.7; 2 1,-3.7 | smd 1.6 x 3.4: NC1 -3.4,1.5; NC2 3.4,1.5
1X02 = drill 1.016 pad 1.88: 1 0,0; 2 2.54,0
1X05 = drill 1.016 pad 1.88: 1 0,0; 2 2.54,0; 3 5.08,0; 4 7.62,0; 5 10.16,0
LPS3015 = smd 1.14 x 3.3: 1 -1.27,0; 2 1.27,0
0805 = smd 1.3 x 1.5: 1 -0.95,0; 2 0.95,0
JD-T1800 = smd 0.5 x 2: 1 5.2,-13.1; 2 4.4,-13.1; 3 3.6,-13.1; 4 2.8,-13.1; 5 2,-13.1; 6 1.2,-13.1; 7 0.4,-13.1; 8 -0.4,-13.1; 9 -1.2,-13.1; 10 -2,-13.1; 11 -2.8,-13.1; 12 -3.6,-13.1; 13 -4.4,-13.1; 14 -5.2,-13.1 | hole 0.6: -12.8,-16.9; 7.65,-16.9
LED-0603 = smd 1 x 1: A 0,-0.877; C 0,0.877
LED_597-2311-407F = smd 1.499 x 1.499: 1 0,1.702; 2 0,-1.702 | smd 0.66 x 0.889: 3 -0.66,0
PAD-JUMPER-2-NC_BY_TRACE_YES_SILK = smd 0.635 x 1.27: 1 -0.508,0; 2 0.508,0
TACTILE-SWITCH-1101NE = smd 2.3 x 1.6: P$1 -3.15,0; P$2 3.15,0
SOT23-3 = smd 0.8 x 0.9: 1 -0.95,-1; 2 0.95,-1; 3 0,1.1
0603-RES = smd 1.1 x 1: 1 -0.85,0; 2 0.85,0
EXB34V = smd 0.5 x 0.5: 1 -0.5,-0.7; 2 0.5,-0.7; 3 0.5,0.7; 4 -0.5,0.7
PTS645_BUTTON_SERIES = smd 1.55 x 1.3: P$1 -3.975,2.25; P$2 3.975,2.25; P$3 -3.975,-2.25; P$4 3.975,-2.25
PAD-JUMPER-3-2OF3_NC_BY_TRACE_YES_SILK_FULL_BOX = smd 0.635 x 1.27: 1 -0.813,0; 2 0,0; 3 0.813,0
PAD-JUMPER-2-NO_YES_SILK = smd 0.635 x 1.27: 1 -0.45,0; 2 0.45,0
PAD-016 = drill 0.406: 1 0,0
SOT23-5 = smd 0.55 x 1.2: 1 -0.95,-1.3; 2 0,-1.3; 3 0.95,-1.3; 4 0.95,1.3; 5 -0.95,1.3
QFN-10_PAD = smd 0.297 x 0.85: 1 -1,-1.475; 2 -0.5,-1.475; 3 0,-1.475; 4 0.5,-1.475; 5 1,-1.475; 6 1,1.475; 7 0.5,1.475; 8 0,1.475; 9 -0.5,1.475; 10 -1,1.475 | smd 0.7 x 0.28: 11 -1.5,0.25; 12 -1.5,-0.25; 13 1.5,0.25; 14 1.5,-0.25 | smd 2.4 x 1.65: 15 0,0
LED-TRICOLOR-5050-IC = smd 2 x 1.1: 1 -2.4,1.7; 2 -2.4,0; 3 -2.4,-1.7; 4 2.4,-1.7; 5 2.4,0; 6 2.4,1.7
TDFN-8 = smd 0.8 x 0.3: 1 -1.4,0.75; 2 -1.4,0.25; 3 -1.4,-0.25; 4 -1.4,-0.75; 5 1.4,-0.75; 6 1.4,-0.25; 7 1.4,0.25; 8 1.4,0.75 | smd 1.5 x 1.88: EP 0,0
MK20DX256VLH7 = smd 1.1 x 0.285: 1 -5.7,3.75; 2 -5.7,3.25; 3 -5.7,2.75; 4 -5.7,2.25; 5 -5.7,1.75; 6 -5.7,1.25; 7 -5.7,0.75; 8 -5.7,0.25; 9 -5.7,-0.25; 10 -5.7,-0.75; 11 -5.7,-1.25; 12 -5.7,-1.75; 13 -5.7,-2.25; 14 -5.7,-2.75; 15 -5.7,-3.25; 16 -5.7,-3.75; 33 5.7,-3.75; 34 5.7,-3.25; 35 5.7,-2.75; 36 5.7,-2.25; 37 5.7,-1.75; 38 5.7,-1.25; 39 5.7,-0.75; 40 5.7,-0.25; 41 5.7,0.25; 42 5.7,0.75; 43 5.7,1.25; 44 5.7,1.75; 45 5.7,2.25; 46 5.7,2.75; 47 5.7,3.25; 48 5.7,3.75 | smd 0.285 x 1.1: 17 -3.75,-5.7; 18 -3.25,-5.7; 19 -2.75,-5.7; 20 -2.25,-5.7; 21 -1.75,-5.7; 22 -1.25,-5.7; 23 -0.75,-5.7; 24 -0.25,-5.7; 25 0.25,-5.7; 26 0.75,-5.7; 27 1.25,-5.7; 28 1.75,-5.7; 29 2.25,-5.7; 30 2.75,-5.7; 31 3.25,-5.7; 32 3.75,-5.7; 49 3.75,5.7; 50 3.25,5.7; 51 2.75,5.7; 52 2.25,5.7; 53 1.75,5.7; 54 1.25,5.7; 55 0.75,5.7; 56 0.25,5.7; 57 -0.25,5.7; 58 -0.75,5.7; 59 -1.25,5.7; 60 -1.75,5.7; 61 -2.25,5.7; 62 -2.75,5.7; 63 -3.25,5.7; 64 -3.75,5.7
MINI54TAN = smd 0.203 x 1.5: 1 -2.75,-4.5; 2 -2.25,-4.5; 3 -1.75,-4.5; 4 -1.25,-4.5; 5 -0.75,-4.5; 6 -0.25,-4.5; 7 0.25,-4.5; 8 0.75,-4.5; 9 1.25,-4.5; 10 1.75,-4.5; 11 2.25,-4.5; 12 2.75,-4.5; 25 2.75,4.5; 26 2.25,4.5; 27 1.75,4.5; 28 1.25,4.5; 29 0.75,4.5; 30 0.25,4.5; 31 -0.25,4.5; 32 -0.75,4.5; 33 -1.25,4.5; 34 -1.75,4.5; 35 -2.25,4.5; 36 -2.75,4.5 | smd 1.5 x 0.203: 13 4.5,-2.75; 14 4.5,-2.25; 15 4.5,-1.75; 16 4.5,-1.25; 17 4.5,-0.75; 18 4.5,-0.25; 19 4.5,0.25; 20 4.5,0.75; 21 4.5,1.25; 22 4.5,1.75; 23 4.5,2.25; 24 4.5,2.75; 37 -4.5,2.75; 38 -4.5,2.25; 39 -4.5,1.75; 40 -4.5,1.25; 41 -4.5,0.75; 42 -4.5,0.25; 43 -4.5,-0.25; 44 -4.5,-0.75; 45 -4.5,-1.25; 46 -4.5,-1.75; 47 -4.5,-2.25; 48 -4.5,-2.75
QT2120 = smd 1.473 x 0.356: 1 -2.819,2.921; 2 -2.819,2.286; 3 -2.819,1.626; 4 -2.819,0.965; 5 -2.819,0.33; 6 -2.819,-0.33; 7 -2.819,-0.965; 8 -2.819,-1.626; 9 -2.819,-2.286; 10 -2.819,-2.921; 11 2.819,-2.921; 12 2.819,-2.286; 13 2.819,-1.626; 14 2.819,-0.965; 15 2.819,-0.33; 16 2.819,0.33; 17 2.819,0.965; 18 2.819,1.626; 19 2.819,2.286; 20 2.819,2.921
SO08 = smd 0.66 x 2.032: 1 1.905,3.073; 2 0.635,3.073; 3 -0.635,3.073; 4 -1.905,3.073; 5 -1.905,-3.073; 6 -0.635,-3.073; 7 0.635,-3.073; 8 1.905,-3.073
QTWHEELMODULE = drill 1.016 pad 1.88: CH0 10.897,-14.478; CH1 12.693,-12.682; CH2 14.489,-10.886 | hole 4: 16.454,9.5; -16.454,9.5; 0,-19
CRYSTAL-TXC-7A = smd 1.7 x 2.4: P$1 1.85,0; P$2 -1.85,0
CRYSTAL-SMD-5X3 = smd 1.9 x 1.1: 1 -1.85,-1.15; 2 1.85,-1.15; 3 1.85,1.15; 4 -1.85,1.15

### Placement (x,y rotation side)
C1  20.95,4.57 90 top
C2  24.64,4.57 90 top
C3  19.81,13.21 0 top
C4  19.81,11.43 0 top
C5  63.5,27.94 90 top
C6  27.3,29.84 0 top
C7  45.09,2.54 180 bottom
C8  45.09,15.24 180 bottom
C9  22.23,20.83 180 top
C10  24.77,17.78 90 top
C11  71.75,10.16 0 top
C12  45.09,27.94 180 bottom
C13  84,3.3 270 top
C14  95.2,15.16 270 top
C15  55.88,36.7 180 top
C16  74.93,13.34 270 top
C17  71.75,12.7 0 top
C18  78.49,23.24 0 top
C19  64.9,11.18 270 top
C20  67.31,11.18 270 top
C21  78.74,18.29 0 top
C22  81.92,16.13 270 top
C23  32.51,8.89 0 top
D1  36.83,16.51 90 top
D2  39.37,16.51 270 top
D3  29.21,19.05 180 top
D4  29.21,21.08 180 top
D5  22.23,23.01 0 top
J1  0,27.3 270 top
J2  12.7,20.32 270 top
JP1  9.27,7.11 0 top
JP3  40.64,3.68 180 top
JP4  97.54,15.24 90 top
L1  16.51,5.08 270 top
L2  5.08,33.66 180 top
L3  67.94,6.35 180 top
L4  74.93,10.16 90 top
LCD1  71.12,20.32 90 bottom
LED  60.96,27.94 0 top
LED1  1.27,11.43 180 top
OFF  84.2,12.19 90 top
PROGRAM  93.85,31.11 270 top
Q1  53.47,22.61 0 top
Q2  38.1,10.16 180 top
Q3  41.91,7.62 90 top
Q4  27.69,16.26 180 top
Q5  80.39,7.62 270 top
R2  28.7,4.57 90 top
R3  26.67,4.57 270 top
R4  25.65,7.42 180 top
R5  19.43,17.78 270 top
R6  24.64,12.32 270 top
R7  25.65,9.53 0 top
R8  35.31,12.32 270 top
R9  3.3,11.43 270 top
R10  38.1,7.37 0 top
R11  38.1,13.34 180 top
R12  44.83,7.62 270 top
R14  91.69,6.6 270 top
R15  29.21,23.11 0 top
R16  71.75,6.35 0 top
R17  53.47,25.15 180 top
R18  53.47,19.43 0 top
R19  91.69,9.78 270 top
R20  88.65,9.78 270 top
R21  29.21,36.45 90 top
R22  18.16,34.8 180 top
R23  16.38,33.02 180 top
R24  14.61,31.24 180 top
R25  90.55,2.41 270 top
R26  83.06,7.62 90 top
R27  55.88,3.17 0 top
R28  60.33,3.17 0 top
R29  76.83,7.62 270 top
R30  57.15,27.94 0 top
RN1  6.99,27.69 270 top
S2  24.13,20.32 0 bottom
SJ1  57.15,5.08 0 top
SJ2  64.14,6.35 180 top
SJ3  86.23,9.27 0 top
SJ4  48.77,5.08 180 top
SJ5  19.08,2.13 270 top
TP_CS  56.13,16.21 0 top
TP_DC  56.13,20.7 0 top
TP_MOSI  56.13,19.18 0 top
TP_RESET  72.19,29.26 90 top
TP_SCL  61.47,32.42 0 top
TP_SDA  61.47,31.11 0 top
TP_TFT_RESET  56.13,22.3 0 top
U1  22.23,17.78 0 top
U2  20.95,8.26 270 top
U3  44.45,33.02 270 bottom
U4  44.45,20.32 270 bottom
U5  44.45,7.62 270 bottom
U6  87.38,5.08 0 top
U7  68.94,20.41 90 top
U8  88.65,17.42 0 top
U9  24.13,34.29 0 top
U12  55.88,33.02 90 top
U$1  24.13,20.32 90 bottom
Y1  80.01,12.06 0 top
Y2  76.2,29.08 270 top

### Tracks (layer width: path | path; a pad name or v marks a point on that pad's centre or on a via)
3.3V  (via drill 0.28, 0.33)
  Top 0.152: L3.2 67.05,5.09 v67.06,5.08 | 65.19,12.32 C19.1 | 67.02,12.32 C20.1
  Top 0.203: v25.02,29.84 C6.1 | R21.2 v30.48,37.34 | U7.48 64.47,26.11 C5.1 62.27,27.09 v62.23,27.05 | v77.85,24.51 77.85,23.33 C18.1 77.56,23.16 U7.30 | R20.2 88.61,8.89 v87.63,8.89 87.25,9.27 SJ3.2 | R19.2 93.31,8.93 v93.34,8.89 | U6.3 84.68,4.83 C13.1 81.95,4.15 v81.92,4.19 | U7.7 68.19,12.91 C20.1 | L3.2 SJ2.1 | R25.2 88.94,2.83 v88.9,2.79 | R7.2 26.5,11.01 v26.54,11.05 | 65.19,12.32 v66.04,12.32 67.02,12.32 | C19.1 64.9,12.67 66.19,13.97 U7.3 | U12.3 53.98,32.38 55.03,33.44 55.03,34.92 | 55.03,34.92 C15.2 v53.47,36.7 | U12.8 55.03,34.92 | Q5.2 78.37,6.67 v78.36,6.66 | SJ4.1 v52.2,5.08
  Top 0.254: U9.11 26.5,31.37 26.5,29.89 C6.1 25.61,30.68 25.61,32.98 25.96,33.33 U9.14 | JP4.5 97.54,25.65 v96.01,27.18
  Bottom 0.203: LCD1.4 v59.94,23.12 v59.94,23.11 | LCD1.11 v56.01,17.52 v56.01,17.53
  Bottom 0.254: LCD1.4 | v44.2,13.59 C8.1 44.45,15.46 U4.5 44.45,20.32 46.15,22.02 U4.3 | U5.3 46.15,9.32 44.45,7.62 U5.5 44.45,2.75 C7.1 v42.55,2.54
  Bottom 0.305: LCD1.11 LCD1.10
  Bottom 0.356: U3.3 46.15,34.72 44.45,33.02 U3.5 44.45,28.16 C12.1 v44.2,26.54
  other vias: 61.47,25.02 16.64,12.7 16.64,11.68 16.64,10.67 16.64,9.65 16.64,13.59 17.65,13.59 17.65,12.7 17.65,11.68 17.65,10.67 17.65,9.65 15.49,13.59 15.49,12.7 15.49,11.68 15.49,10.67 15.49,9.65
  pour 3V3: 1.91,1.91 97.16,1.91 97.16,38.73 1.91,38.73
  pour Top (isolate 0.203, no thermals): 19.68,8.51 19.05,8.51 17.65,8.89 14.99,8.89 14.99,14.1 19.43,14.1 19.43,12.19 18.03,12.19 18.03,9.53 18.54,9.02 19.68,9.02
5VIN
  Top 0.203: 1.07,13.13 LED1.2 4.52,16.38 15.88,16.38 17.27,17.78 20.32,17.78 20.7,18.16 22.86,18.16 23.18,18.48 U1.4 | C9.1 23.18,20.73 | 30.36,22.81 D4.C 30.09,21.08 D3.A 28.64,18.47 Q4.1
  Top 0.356: R15.2 30.36,22.81
  Top 0.406: 23.18,20.73 U1.4 | C9.1 24.89,20.83 25.78,19.94 26.67,19.05 D3.A | C9.1 23.38,21.13 | D5.C 21.07,22.83 C9.1
BUTTON  (via drill 0.33, 0.38)
  Top 0.203: v37.34,21.72 36.83,21.21 D1.A 35.31,16.14 R8.1
  Top 0.254: v68.58,29.46 69.19,28.85 U7.40
  Bottom 0.254: v68.58,29.46 59.18,38.86 43.18,38.86 40.64,36.32 40.64,25.02 v37.34,21.72
CHARGEALERT  (via drill 0.33)
  Top 0.203: U7.26 83.52,21.16 v83.84,21.41 | v90.55,4.32 R25.1 | U6.5 v90.54,4.33 v90.55,4.32 | v90.55,4.32 92.58,4.32 93.98,5.71 93.98,12.06 v92.58,13.46
  Bottom 0.203: v83.84,21.41 87.17,21.41 88.9,19.68 88.9,17.14 v92.58,13.46
CHARGESTAT  (via drill 0.33)
  Top 0.203: R9.1 3.52,12.28 7.11,15.88 21.3,15.88 U1.1 21.27,17.21 21.84,17.78 v25.78,17.78 | v37.97,29.97 46.23,29.97 49.53,26.67 55.37,26.67 61.88,20.16 U7.57
  Bottom 0.203: v25.78,17.78 v37.97,29.97
DAC  (via drill 0.33)
  Top 0.203: U7.18 75.55,17.16 v76.83,15.88
  Bottom 0.203: v76.83,15.88 76.83,10.16 77.47,9.53 89.53,9.53 97.54,17.53 JP4.2
EXT_CLK
  Top 0.203: U7.28 83.12,22.16 86.36,25.4 92.46,25.4 95,22.86 arc-90 95.26,22.6 95.26,22.53 arc90 95.52,22.27 95.68,22.27 arc90 95.94,22.53 95.94,22.6 arc-90 96.2,22.86 JP4.4
EXT_DATA
  Top 0.152: JP4.3 96.52,20.32
  Top 0.203: U7.27 83.26,21.66 86.36,24.77 92.08,24.77 96.52,20.32
FB
  Top 0.203: U2.10 24.53,9.26 R7.1 24.8,11.3 R6.2
GND  (via drill 0.25, 0.28, 0.33, 0.38)
  Top 0.152: U1.2 v22.23,15.37 | U7.31 74.12,23.66 73.66,24.13 v73.66,25.4 | v7.62,17.78 10.44,17.78 11.71,19.05 J2.5
  Top 0.203: 63.92,28.79 C5.2 63.46,28.83 | 81.94,15.25 C22.2 82.02,15.17 | C18.2 79.38,23.15 | C13.2 84.1,2.45 U6.4 | U7.4 66.69,13.82 v67.31,13.21
  Top 0.254: U8.47 82.02,15.17 | U7.47 65.69,27.4 v65.66,27.43
  other vias: 27.69,6.48 92.46,2.67 91.44,20.19 81.03,18.29 79.38,24.51 21.34,7.49 21.34,9.02 20.57,7.49 20.57,9.02 20.95,8.26 5.08,39.88 7.62,39.88 10.16,39.88 22.86,39.88 30.48,39.88 38.1,39.88 43.18,39.88 48.26,39.88 55.88,39.88 60.96,39.88 68.58,39.88 73.66,39.88 81.28,39.88 86.36,39.88 93.98,39.88 98.3,34.29 98.3,31.75 98.3,27.3 98.3,13.34 98.3,8.89 98.3,6.35 93.98,0.76 88.9,0.76 81.28,0.76 76.2,0.76 68.58,0.76 63.5,0.76 55.88,0.76 50.8,0.76 43.18,0.76 38.1,0.76 22.86,0.76 17.78,0.76 12.7,0.76 5.08,0.76 0.76,6.35 0.89,21.59 0.76,35.56 21.97,13.59 22.86,12.7 22.86,10.79 6.99,0.76 12.7,39.88 15.24,39.88 17.78,39.88 20.32,39.88 33.02,39.88 35.56,39.88 40.64,39.88 45.72,39.88 50.8,39.88 53.34,39.88 58.42,39.88 63.5,39.88 66.04,39.88 76.2,39.88 78.74,39.88 83.82,39.88 88.9,39.88 91.44,39.88 86.36,0.76 83.82,0.76 78.74,0.76 73.66,0.76 66.04,0.76 60.96,0.76 53.34,0.76 58.42,0.76 48.26,0.76 45.72,0.76 40.64,0.76 15.24,0.76 20.32,0.76 0.89,19.05 0.89,16.51 5.08,36.83 7.62,36.83 10.16,36.83 15.24,36.83 17.78,36.83 38.1,36.83 7.62,21.59 7.62,24.13 5.08,24.13 7.62,34.29 3.81,8.89 53.34,3.81 63.5,3.81 66.04,3.81 68.58,3.81 66.04,8.89 71.12,8.89 78.74,3.81 76.2,3.81 73.66,3.81 87.25,11.3 96.52,11.43 96.52,8.89 96.52,6.35 93.98,3.81 86.36,16.51 91.44,16.51 68.58,19.05 78.74,26.67 83.82,26.67 83.82,24.13 86.36,26.67 88.9,26.67 91.44,26.67 91.44,29.21 88.9,29.21 86.36,29.21 78.74,29.21 78.74,31.75 91.44,31.75 91.44,36.83 88.9,36.83 86.36,36.83 83.82,36.83 81.28,36.83 78.74,36.83 73.66,36.83 71.12,36.83 68.58,36.83 66.04,36.83 63.5,36.83 71.12,34.29 73.66,34.29 76.2,34.29 78.74,34.29 73.66,31.75 71.12,31.75 48.26,34.29 48.26,31.75 50.8,21.59 86.36,34.29 96.52,34.29 96.52,31.75 96.52,29.21 93.98,21.59 88.9,34.29 91.44,34.29 21.97,10.79 22.86,11.81 21.97,12.7 22.86,13.59 21.97,11.81 17.78,16.76 24.51,19.94 35.56,21.59 33.02,21.59 34.29,11.18 38.1,6.35 19.05,20.32 26.04,12.32 28.57,13.59 27.3,13.59 26.04,13.59 28.57,11.05 28.57,12.32 28.57,9.78 27.3,12.32 92.96,7.62 86.36,7.62 88.9,7.62 73.66,7.62 76.2,10.16 76.2,12.7 76.2,15.24 80.01,12.7 80.01,11.43 87.88,14.73 76.2,29.21 45.72,26.67 50.8,24.13 48.26,24.13 43.18,13.97 45.72,13.97 45.72,11.43 48.26,11.43 38.1,34.29 6.99,2.03 6.99,3.3 6.99,4.57 6.99,5.84 7.62,8.89 7.62,11.43 7.62,13.97 3.81,13.97 35.56,29.21 50.8,13.97 48.26,16.51 60.96,15.24 59.69,10.16 40.64,24.13 43.56,33.91 48.26,21.59 50.8,19.05 53.34,16.51 43.18,26.67 10.16,34.29 7.62,31.75 84.84,13.46 43.18,36.83 24.13,36.83 24.13,34.29 24.13,31.75 24.13,29.21 30.48,29.21 66.04,34.29 68.58,34.29 81.28,34.29 83.82,34.29 81.28,31.75 83.82,31.75 88.9,31.75 86.36,31.75 81.28,29.21 83.82,29.21 81.28,26.67 81.28,24.13 92.71,21.59 50.8,27.94 50.8,31.75 50.8,34.29 55.88,31.75 58.42,29.21 58.42,26.67 35.56,19.05 38.1,19.05 40.64,19.05 40.64,16.51 40.64,13.97 40.64,11.43 43.18,11.43 33.02,19.05 33.02,13.97 12.7,36.83 35.56,34.29 3.81,6.35 33.02,10.16 34.29,10.16 33.02,11.43 34.29,7.62 33.02,7.62 33.02,12.7 34.29,13.97 34.29,12.7 26.67,22.86 48.26,36.83 50.8,36.83 88.9,24.13 91.44,24.13 45.72,24.13 33.02,29.21 50.8,3.81 48.26,3.81
  pour Top (isolate 0.254, rank 3): 0,0 0,40.64 99.06,40.64 99.06,0
  pour Bottom (isolate 0.254): 0,40.64 99.06,40.64 99.06,0 0,0
  pour GND: 0,0 99.06,0 99.06,40.64 0,40.64
  pour 3V3 (rank 2, no thermals): 0,0 99.06,0 99.06,40.64 0,40.64
  pour Top (isolate 0.254, no thermals): 23.5,14.1 20.32,14.1 20.32,5.71 21.59,5.71 21.59,10.16 23.5,10.16
ID  (via drill 0.33)
  Top 0.203: U8.38 74.64,19.67 U7.23 74.62,19.68 69.98,19.68 v68.07,17.78 | J1.4 5.09,26.66 6.35,25.4 9.27,25.4 9.65,25.78 37.08,25.78 51.44,11.43 v61.72,11.43
  Bottom 0.203: v61.72,11.43 v68.07,17.78
KILL
  Top 0.203: R12.1 59.65,8.47 65.19,14.01 U7.1
MOSI  (via drill 0.38)
  Top 0.254: v64.77,22.73 64.34,23.16 U7.51
  Bottom 0.203: LCD1.8 56.88,19.92 TP_MOSI.1
  Bottom 0.254: LCD1.8 58.04,19.94 62.36,19.94 64.77,22.35 v64.77,22.73
N$1
  Top 0.203: Q5.3 82.21,7.62 R26.2
  Top 0.254: 83.06,8.57 83.76,9.27 | 83.76,9.27 SJ3.1 | 83.76,9.27 84.2,9.71 OFF.1
  Top 0.406: 83.06,8.57 R26.2
N$2
  Top 0.305: U2.3 18.41,8.26 L1.1
N$3
  Top 0.203: R11.1 39.37,13.76 D2.A
  Top 0.254: Q3.3 40.81,9.4 Q2.1
  Top 0.305: Q2.1 38.95,11.26 R11.1
N$4
  Top 0.254: Q3.1 43.01,6.77 R12.2
N$6  (via drill 0.33)
  Top 0.203: D2.C 39.13,17.66 D1.C v36.83,14.48
  Bottom 0.254: v36.83,14.48 35.31,14.48 31.75,18.03 28.14,18.03 S2.P$3
N$8
  Top 0.203: LED1.1 2.45,9.73 R9.2
N$9  (via drill 0.33)
  Top 0.203: C21.1 77.89,18.66 U7.21 71.62,18.66 v68.96,16 | v62.48,9.53 59.05,6.1 57.53,6.1 57.15,5.71 SJ1.2
  Bottom 0.203: v62.48,9.53 v68.96,16
N$10
  Top 0.203: U8.42 U8.43
  Top 0.254: OFF.2 84.2,13.21 83.31,14.1 81.53,14.1 80.77,14.86 80.77,16.64 81.11,16.98 C22.1 82.11,17.17 U8.43
N$11
  Top 0.203: R5.1 19.88,19.08 U1.5
N$12
  Top 0.203: U7.53 61.66,22.16 60.96,22.86 LED.A
N$13  (via drill 0.33)
  Top 0.406: J1.1 v5.41,28.6 | D5.A v24.77,23.01
  Bottom 0.406: v5.41,28.6 21.31,28.6 24.77,25.15 v24.77,23.01
N$14
  Top 0.203: JP3.1 46.56,3.68 SJ4.3
N$15
  Top 0.203: U8.37 74.64,20.17 U7.24
N$16
  Top 0.203: U9.7 20.48,33.33 R22.1
N$17
  Top 0.203: R23.1 19.05,33.02 19.41,32.66 U9.8
N$18
  Top 0.203: LED.C 58.88,28.82 R30.2
N$19  (via drill 0.33)
  Top 0.254: U8.20 94.37,18.17 v95.25,19.05 | v95.25,25.4 95.25,26.57 PROGRAM.P$2
  Bottom 0.254: v95.25,19.05 v95.25,25.4
N$20
  Top 0.203: SJ1.1 56.34,5.89 56.13,6.1 48.97,6.1 48.77,5.89 SJ4.2 48.13,5.08
N$22
  Top 0.203: U8.18 94.04,17.17 C14.1
N$27
  Top 0.203: Y2.3 77.35,25.28 76.23,24.16 U7.32
N$28
  Top 0.254: U7.33 72.69,28.58 Y2.1
N$29
  Top 0.203: U7.19 76.06,17.66 78.74,14.99 78.74,12.06 Y1.P$2
N$30
  Top 0.203: U7.20 76.39,18.16 81.86,12.7 Y1.P$1
N$31
  Top 0.254: R27.2 57.91,3.17 | 57.91,3.17 R28.1 | SJ1.3 57.96,3.23 57.91,3.17
N$33  (via drill 0.38)
  Top 0.203: v55.88,23.88 55.59,23.88 R17.1
  Bottom 0.203: v55.88,23.88 57.98,23.88 LCD1.3
N$34
  Top 0.203: R24.1 18.54,31.24 19.3,32 U9.9
N$37
  Bottom 0.406: U3.1 42.75,33.1 41.4,31.75 41.4,27.18 44.45,24.13 U4.2
N$42
  Top 0.203: Q1.3 53.47,24.3 R17.2
N$43
  Top 0.203: R18.1 52.62,21.51 Q1.1
N$44
  Top 0.203: R22.2 13.26,34.8 U$1.CH2
N$45
  Top 0.203: R23.2 U$1.CH1
N$46
  Top 0.203: R24.2 9.68,31.24 U$1.CH0
N$47
  Bottom 0.406: U4.1 42.75,20.4 41.4,19.05 41.4,14.48 44.45,11.43 U5.2
N$48
  Top 0.203: U6.6 90.77,4.83 R14.2
NEOPIXEL  (via drill 0.38)
  Top 0.254: v67.18,28.83 67.19,27.55 U7.44
  Bottom 0.254: U3.2 47.13,38.1 58.42,38.1 67.18,29.34 v67.18,28.83
PGND
  Top 0.305: U2.4 20.32,7.75 20.32,7.62 20.95,7.62 U2.15 21.59,8.89 21.73,8.76 U2.9
  pour Top (no thermals): 23.5,14.1 20.19,14.1 20.19,10.16 20.32,10.16 20.32,4.7 21.59,4.7 21.59,10.16 23.5,10.16
PS
  Top 0.203: U2.8 27.94,8.26 28.57,7.62 28.57,6.06
  Top 0.305: 28.57,6.06 R2.2
QT_CHANGE
  Top 0.203: U7.36 71.19,30.48 63.58,38.1 50.8,38.1 45.97,33.27 31.54,33.27 R21.1 28.92,35.31 27,35.31
  Top 0.254: 27,35.31 U9.17
RESET_B  (via drill 0.33)
  Top 0.152: 72.19,23.05 70.35,21.21 67.69,21.21 v65.02,18.54 | v52.96,10.79 51.44,10.79 36.83,25.4 9.78,25.4 8.38,24 8.38,22.1 9.2,21.29 11.1,21.29 J2.3
  Top 0.203: U8.8 v89.4,18.66 | v73.03,22.23 72.19,23.05 U7.34 TP_RESET.1
  Bottom 0.152: v65.02,18.54 57.28,10.79 v52.96,10.79
  Bottom 0.203: v89.4,18.66 89.4,19.82 87,22.23 v73.03,22.23
SCK  (via drill 0.38)
  Top 0.254: v65.15,21.34 65.66,21.84 65.66,23.11 65.11,23.66 U7.50
  Bottom 0.254: 58.08,19.18 LCD1.9 62.94,19.12 v65.15,21.34
SCL  (via drill 0.33)
  Top 0.203: U6.7 89.79,5.33 90.4,5.94 90.4,10.54 | 90.4,10.54 U8.10 90.4,18.67 v91.03,19.3 | R19.1 90.48,10.63 90.4,10.54 | v71.5,23.5 70.69,24.3 U7.37 70.69,29.64 67.94,32.38 60.96,32.38 | 60.96,32.38 U12.6 57.66,32.38 55.24,29.97 48.51,29.97 45.97,32.51 30.99,32.51 28.88,34.62 U9.16 | TP_SCL.1 60.99,32.42 60.96,32.38
  Top 0.254: 27,34.67 U9.16 | U7.37 70.69,26.07
  Bottom 0.203: v71.5,23.5 86.94,23.5 91.03,19.41 v91.03,19.3
SDA  (via drill 0.33)
  Top 0.203: U6.8 88.79,5.84 89.66,5.84 89.9,6.08 89.9,10.54 | 26.31,32.66 U9.13 29.57,32.66 30.48,31.75 45.59,31.75 48.13,29.21 55.88,29.21 57.78,31.11 U12.5 TP_SDA.1 67.94,31.11 70.19,28.86 U7.38 70.19,23.79 v71.12,22.86 | 89.9,10.54 U8.9 89.9,19.28 v89.92,19.3 | R20.1 89.81,10.63 89.9,10.54
  Top 0.254: 26.98,32.64 U9.13 | U7.38 70.21,26.08
  Bottom 0.203: v89.92,19.3 89.92,19.94 87,22.86 v71.12,22.86
SOFTPOWER  (via drill 0.33)
  Top 0.203: U2.6 23.35,7.25
  Top 0.254: 38.1,8.8 38.1,8.22 R10.2
  Top 0.305: 23.35,7.25 v23.37,7.24 | 38.1,8.8 Q2.3 38.06,9.02 v36.32,9.02
  Bottom 0.254: v36.32,9.02 25.15,9.02 v23.37,7.24
SWD_CLK  (via drill 0.33, 0.38)
  Top 0.152: U7.22 70.73,19.16 v68.07,16.51 | v57.91,9.14 51.56,9.14 36.45,24.26 19.3,24.26 17.34,22.29 arc90 17.34,22.05 17.54,21.84 arc-90 17.54,21.6 17.34,21.39 arc-90 17.1,21.39 16.89,21.6 arc90 16.65,21.6 16.33,21.29 14.3,21.29 J2.4
  Top 0.203: U7.22 81.9,19.16 v81.92,19.18 | v87.88,19.94 87.88,21.91 U8.32
  Bottom 0.152: v68.07,16.51 60.83,9.14 v57.91,9.14
  Bottom 0.203: v81.92,19.18 87.12,19.18 v87.88,19.94
SWD_DIO  (via drill 0.33, 0.38)
  Top 0.152: U7.25 68.04,20.66 v65.02,17.65 | v56.13,9.65 51.56,9.65 36.58,24.64 14.63,24.64 13.61,23.62 13.61,21.87 J2.2
  Top 0.203: U8.33 U8.34 | U7.25 82.55,20.66 | 82.54,20.68 82.55,20.66 | 82.55,20.66 84.17,20.66 84.45,20.95 84.45,22.23 85.6,23.37 86.61,23.37 86.9,23.09 U8.34 | U8.34
  Bottom 0.152: v56.13,9.65 56.9,9.65 64.9,17.65
  Bottom 0.203: 64.9,17.65 v65.02,17.65
SWD_VCC  (via drill 0.33)
  Top 0.152: v53.34,10.16 51.56,10.16 36.7,25.02 12.95,25.02 v12.04,24.13 11.79,23.88 11.79,22.12 J2.1
  Top 0.203: v74.93,6.35 76.96,6.35 76.96,6.77 | R29.2 76.96,6.77 | 76.96,6.77 77.59,6.77 Q5.1
  Top 0.254: D4.A v26.77,21.08
  Bottom 0.203: v53.34,10.16 57.15,6.35 v74.93,6.35
  Bottom 0.254: v26.77,21.08 18.29,21.08 17.78,21.59 17.78,24.26 16.76,25.27 13.97,25.27 12.83,24.13 v12.04,24.13
TFT_BACKLIGHT
  Top 0.203: R18.2 55.58,18.16 U7.61
TFT_CS  (via drill 0.38)
  Top 0.254: U7.49 65.37,24.16 66.17,23.37 v66.17,21.08
  Bottom 0.203: LCD1.12 56.64,16.71 TP_CS.1 | LCD1.12 61.8,16.72 v66.17,21.08
  Bottom 0.254: LCD1.12
TFT_DC  (via drill 0.38)
  Top 0.203: U7.60 62.1,18.67 v60.07,20.7
  Bottom 0.203: v60.07,20.7 58.04,20.7 LCD1.7
  Bottom 0.254: 58.04,20.83 LCD1.7 56.15,20.72 TP_DC.1
TFT_RESET  (via drill 0.38)
  Top 0.203: v66.17,24.64 66.17,26.09 U7.46
  Bottom 0.203: v66.17,24.64 63.12,24.64 60,21.52 LCD1.6 56.97,21.52 TP_TFT_RESET.1
USB_CON_N
  Top 0.254: RN1.1 6.05,27.95 J1.2
USB_CON_P
  Top 0.254: RN1.2 6.17,27.3 J1.3
USB_D_N
  Top 0.254: U7.6 67.69,15.78 66.76,16.72 65.32,16.72 61.51,12.91 55.33,12.91 40.34,27.89 7.98,27.89 RN1.4
USB_D_P
  Top 0.254: U7.5 67.19,15.7 66.59,16.3 65.52,16.3 64.49,15.28 arc90 64.49,14.91 64.52,14.88 arc-90 64.52,14.52 63.85,13.85 arc-90 63.48,13.85 63.45,13.88 arc90 63.09,13.88 61.71,12.49 55.16,12.49 40.17,27.48 7.98,27.48 RN1.3
USB_SHIELD
  pour Top (no thermals): 0,29.84 0,34.92 5.08,34.92 5.08,29.84
UVLO
  Top 0.203: U2.7 24.54,7.75 | R4.2 24.8,6.1 | C2.2 R3.1
  Top 0.305: 24.54,7.75 R4.2 | 24.8,6.1 C2.2
VAUX
  Top 0.305: U2.1 18.94,9.26 18.67,9.53 18.67,10.88 C4.1
VBATT
  Top 0.203: 53.34,1.91 36.2,1.91 35.56,1.27 28.45,1.27 27.81,1.91 19.18,1.91 | 53.34,1.91 69.22,1.91 72.64,5.33 U6.2 | 54.61,3.17 53.34,1.91 | 19.18,1.91 10.67,1.91 10.16,1.4 10.16,3.3 JP1.2 | SJ5.2 19.18,1.68 19.18,1.91
  Top 0.254: R27.1 54.61,3.17
  pour Top (isolate 0.254, rank 2, no thermals): 9.4,1.14 9.4,15.49 22.73,15.49 22.73,17.27 25.65,17.27 25.65,15.62 28.19,15.62 28.19,14.48 11.05,14.48 11.05,1.14
VCC
  Top 0.203: R11.2 37.25,11.26 Q2.2 35.62,11.16 R8.2 35.31,7.37 34.29,6.35 31.75,6.35 29.12,3.72 R2.1
  pour Top: 27.3,16.64 29.46,16.64 29.46,19.94 32.26,19.94 32.26,2.29 14.99,2.29 14.99,4.32 18.92,4.32 18.92,7.37 19.71,7.37 19.71,4.32 29.46,4.32 29.46,15.88 26.29,15.88 26.29,17.78 27.3,17.78
VDDA
  Top 0.203: U7.13 71.19,12.99 C17.1 69.85,11.64 69.85,7.41 R16.1 L3.1
VREF_OUT
  Top 0.203: 74.72,14.19 C16.1 73.41,15.71 73.41,16.51 73.56,16.66 U7.17
VREFH
  Top 0.203: U7.14 71.69,10.95 C11.1 72.61,8.46 R16.2
VREFL
  Top 0.203: U7.15 U7.16 72.69,12.79 C17.2 74.72,12.7 C16.2 L4.2 74.03,10.16 C11.2
VREGIN
  Top 0.203: SJ2.2 63.63,7.11 64.14,7.62 67.31,7.62 68.69,9.01 U7.8

### Text on the board
tPlace: Little Helper / Board Rev 1.9 | appfruits.com | Copyright 2015 / Phillip Schuster | Made in / Hamburg, Germany | 3V3 | LEDK | CLK | SWD | DAT | DAC | GND | SWDDIO | BL | SWDCLK | U2 | ON | RTC / CC SEL | RTC / BATT SEL | CC | VR | COIN / CELL | LIPO | + | VREGIN / 3.3V | LS OFF | COIN CELL